# Altium schematic sheet EVK xA1.SchDoc
size A2
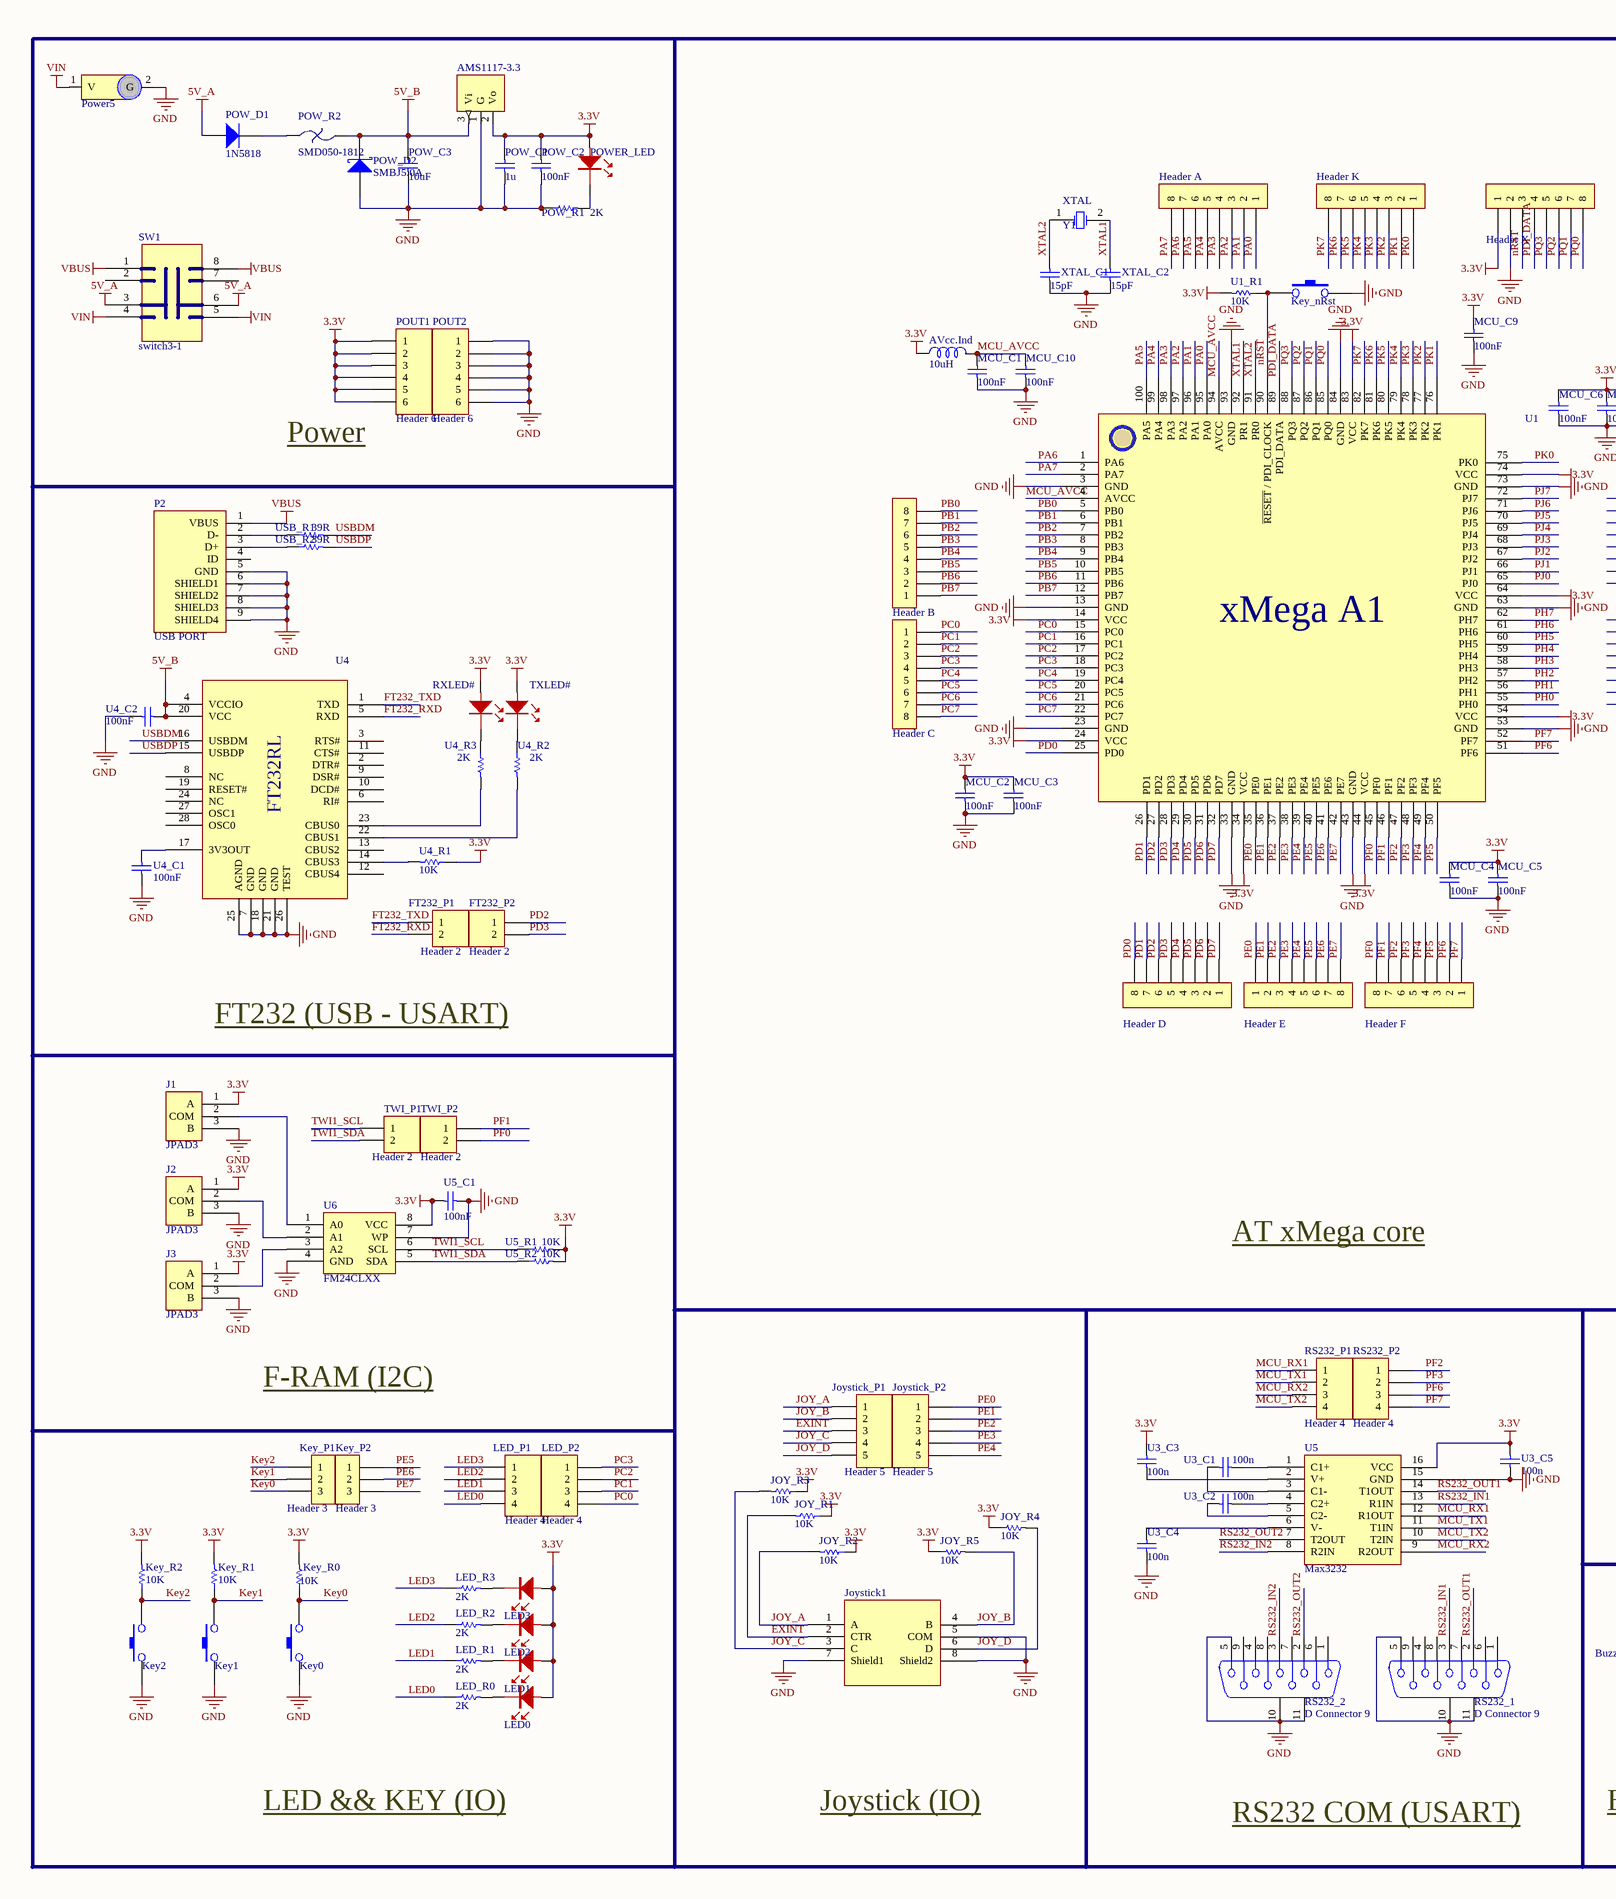
[diagram p0: EVK xA1.SchDoc, left]
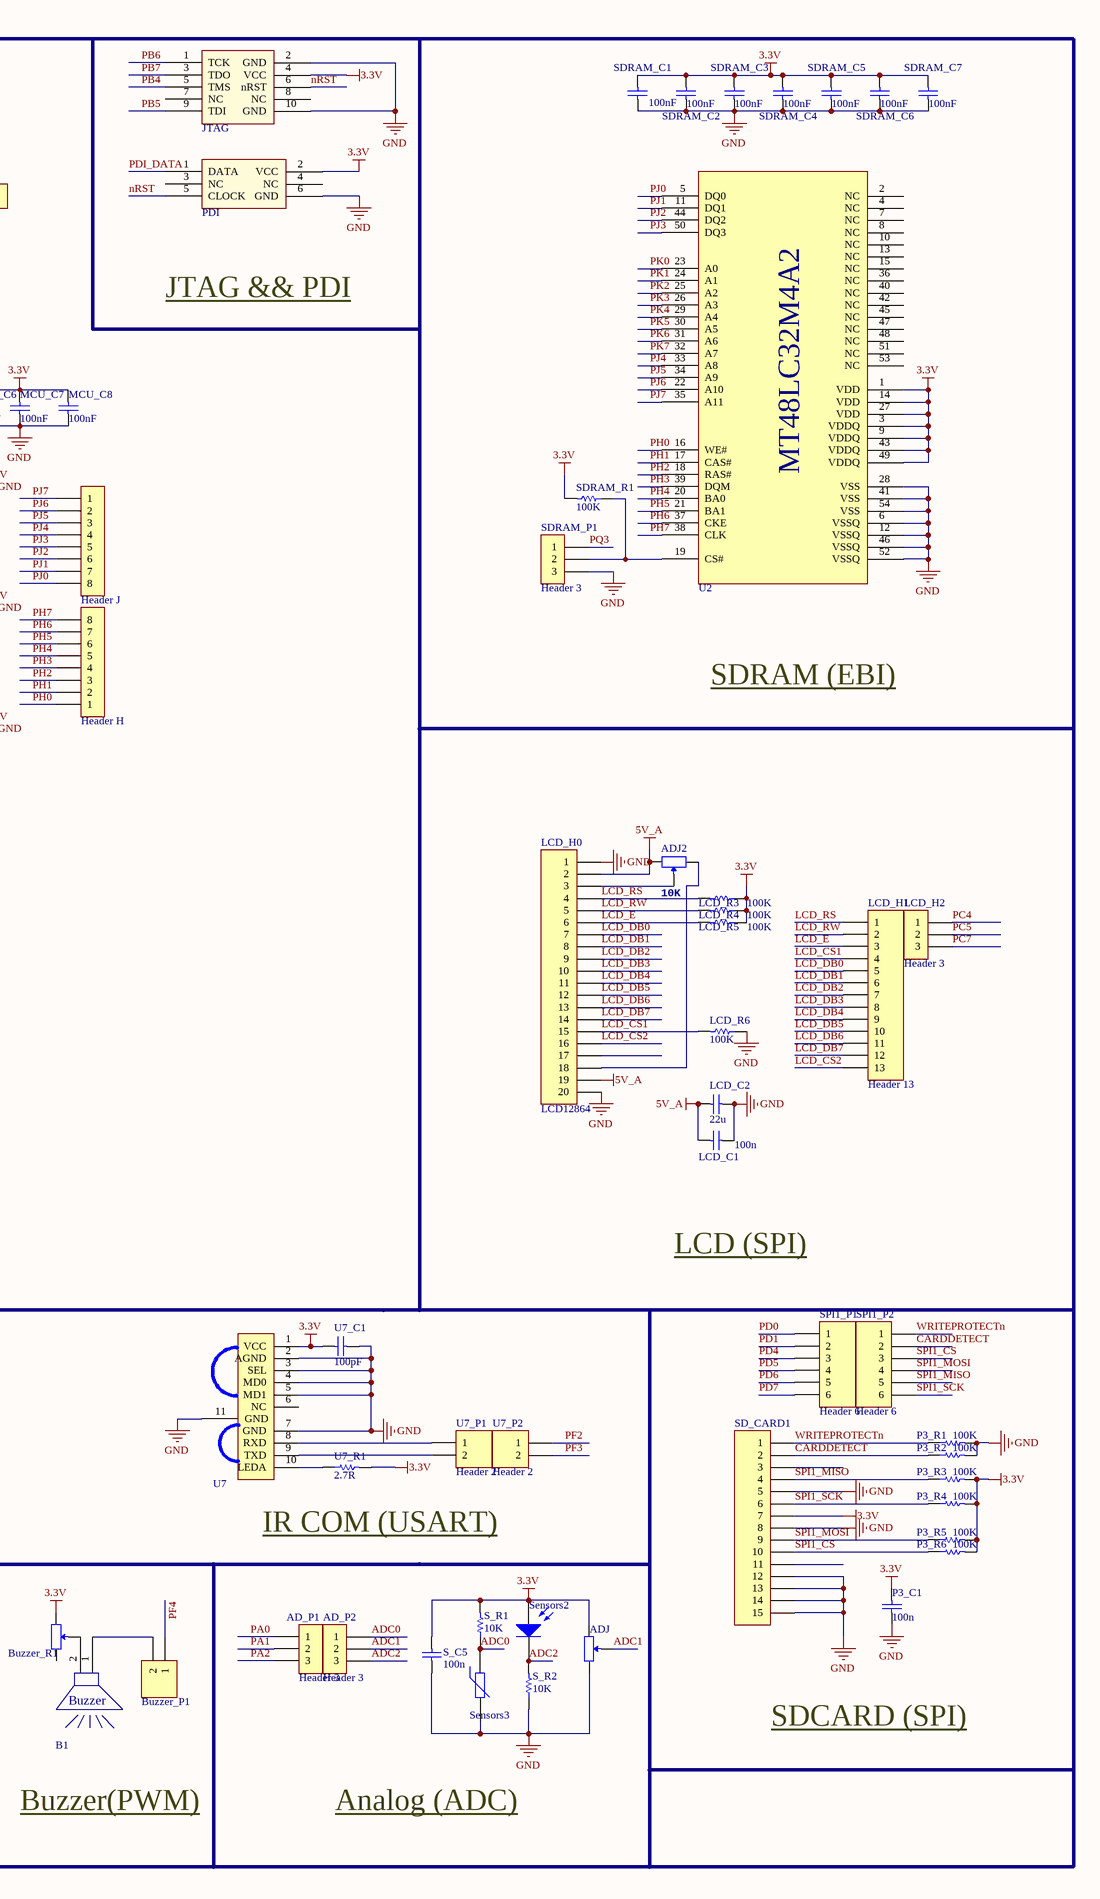
[diagram p1: EVK xA1.SchDoc, right]

## Parts
AD_P1  Header 3  [SIP3]
AD_P2  Header 3  [SIP3]
ADJ  RES_ADJ  [RESADJ]  (value not drawn)
ADJ2  10K  [RESADJ]
AMS1117-3.3  LD1117  [LD1117-3.3]  (value not drawn)
AVcc.Ind  10uH  [RES]
B1  Buzzer  [buzzer]  (value not drawn)
Buzzer_P1  Header 2  [SIP2]  (value not drawn)
Buzzer_R1  RES_ADJ  [RESADJ2]  (value not drawn)
FT232_P1  Header 2  [SIP2]
FT232_P2  Header 2  [SIP2]
Header_A  Header 8  [SIP8]  (value not drawn)
Header_B  Header 8  [SIP8]  (value not drawn)
Header_C  Header 8  [SIP8]  (value not drawn)
Header_D  Header 8  [SIP8]  (value not drawn)
Header_E  Header 8  [SIP8]  (value not drawn)
Header_F  Header 8  [SIP8]  (value not drawn)
Header_H  Header 8  [SIP8]  (value not drawn)
Header_J  Header 8  [SIP8]  (value not drawn)
Header_K  Header 8  [SIP8]  (value not drawn)
Header_X  Header 8  [SIP8]  (value not drawn)
J1  JPAD3  [JPAD3]
J2  JPAD3  [JPAD3]
J3  JPAD3  [JPAD3]
JOY_R1  value 10K  [0805]  (hidden comment: R_0805)
JOY_R2  value 10K  [0805]  (hidden comment: R_0805)
JOY_R3  value 10K  [0805]  (hidden comment: R_0805)
JOY_R4  value 10K  [0805]  (hidden comment: R_0805)
JOY_R5  value 10K  [0805]  (hidden comment: R_0805)
Joystick1  Joystick  [Joystick]  (value not drawn)
Joystick_P1  Header 5  [SIP5]
Joystick_P2  Header 5  [SIP5]
JTAG  JTAG  [ISP_10]  (value not drawn)
Key0  PB2  [KEY]  (value not drawn)
Key1  PB2  [KEY]  (value not drawn)
Key2  PB2  [KEY]  (value not drawn)
Key_nRst  PB2  [KEY]  (value not drawn)
Key_P1  Header 3  [SIP3]
Key_P2  Header 3  [SIP3]
Key_R0  value 10K  [0805]  (hidden comment: R_0805)
Key_R1  value 10K  [0805]  (hidden comment: R_0805)
Key_R2  value 10K  [0805]  (hidden comment: R_0805)
LCD_C1  value 100n  [0805]  (hidden comment: C_0805)
LCD_C2  value 22u  [0805]  (hidden comment: C_0805)
LCD_H0  LCD12864  [SIP20]
LCD_H1  Header 13  [SIP13]
LCD_H2  Header 3  [SIP3]
LCD_R3  value 100K  [0805]  (hidden comment: R_0805)
LCD_R4  value 100K  [0805]  (hidden comment: R_0805)
LCD_R5  value 100K  [0805]  (hidden comment: R_0805)
LCD_R6  value 100K  [0805]  (hidden comment: R_0805)
LED0  LED_0805  [0805_LED]  (value not drawn)
LED1  LED_0805  [0805_LED]  (value not drawn)
LED2  LED_0805  [0805_LED]  (value not drawn)
LED3  LED_0805  [0805_LED]  (value not drawn)
LED_P1  Header 4  [SIP4]
LED_P2  Header 4  [SIP4]
LED_R0  value 2K  [0805]  (hidden comment: R_0805)
LED_R1  value 2K  [0805]  (hidden comment: R_0805)
LED_R2  value 2K  [0805]  (hidden comment: R_0805)
LED_R3  value 2K  [0805]  (hidden comment: R_0805)
MCU_C1  value 100nF  [0805]  (hidden comment: C_0805)
MCU_C2  value 100nF  [0805]  (hidden comment: C_0805)
MCU_C3  value 100nF  [0805]  (hidden comment: C_0805)
MCU_C4  value 100nF  [0805]  (hidden comment: C_0805)
MCU_C5  value 100nF  [0805]  (hidden comment: C_0805)
MCU_C6  value 100nF  [0805]  (hidden comment: C_0805)
MCU_C7  value 100nF  [0805]  (hidden comment: C_0805)
MCU_C8  value 100nF  [0805]  (hidden comment: C_0805)
MCU_C9  value 100nF  [0805]  (hidden comment: C_0805)
MCU_C10  value 100nF  [0805]  (hidden comment: C_0805)
P2  USB PORT  [USB2]
P3_C1  value 100n  [0805]  (hidden comment: C_0805)
P3_R1  value 100K  [0805]  (hidden comment: R_0805)
P3_R2  value 100K  [0805]  (hidden comment: R_0805)
P3_R3  value 100K  [0805]  (hidden comment: R_0805)
P3_R4  value 100K  [0805]  (hidden comment: R_0805)
P3_R5  value 100K  [0805]  (hidden comment: R_0805)
P3_R6  value 100K  [0805]  (hidden comment: R_0805)
PDI  PDI  [ISP_6]  (value not drawn)
POUT1  Header 6  [SIP6]
POUT2  Header 6  [SIP6]
POW_C1  value 1u  [0805]  (hidden comment: C_0805)
POW_C2  value 100nF  [0805]  (hidden comment: C_0805)
POW_C3  value 10uF  [0805]  (hidden comment: C_0805)
POW_D1  1N5818  [diode]
POW_D2  SMBJ5.0A  [SMBJ]
POW_R1  value 2K  [0805]  (hidden comment: R_0805)
POW_R2  SMD050-1812  [SMD-1812]
Power5  5V  [PWR_5V]  (value not drawn)
POWER_LED  LED_0805  [0805_LED]  (value not drawn)
RS232_1  D Connector 9  [DB9_2]
RS232_2  D Connector 9  [DB9_2]
RS232_P1  Header 4  [SIP4]
RS232_P2  Header 4  [SIP4]
RXLED#  LED_0805  [0805_LED]  (value not drawn)
S_C5  value 100n  [0805]  (hidden comment: C_0805)
S_R1  value 10K  [0805]  (hidden comment: R_0805)
S_R2  value 10K  [0805]  (hidden comment: R_0805)
SD_CARD1  SDCARD  [SDK]  (value not drawn)
SDRAM_C1  value 100nF  [0805]  (hidden comment: C_0805)
SDRAM_C2  value 100nF  [0805]  (hidden comment: C_0805)
SDRAM_C3  value 100nF  [0805]  (hidden comment: C_0805)
SDRAM_C4  value 100nF  [0805]  (hidden comment: C_0805)
SDRAM_C5  value 100nF  [0805]  (hidden comment: C_0805)
SDRAM_C6  value 100nF  [0805]  (hidden comment: C_0805)
SDRAM_C7  value 100nF  [0805]  (hidden comment: C_0805)
SDRAM_P1  Header 3  [SIP3]
SDRAM_R1  value 100K  [0805]  (hidden comment: R_0603)
Sensors2  Photo Sen  [LED]  (value not drawn)
Sensors3  Res Varistor  [diode]  (value not drawn)
SPI1_P1  Header 6  [SIP6]
SPI1_P2  Header 6  [SIP6]
SW1  switch3-1  [Switch3-1]
TWI_P1  Header 2  [SIP2]
TWI_P2  Header 2  [SIP2]
TXLED#  LED_0805  [0805_LED]  (value not drawn)
U1  xMega A1  [TQFP100 CORE]  (value not drawn)
U1_R1  value 10K  [0805]  (hidden comment: R_0805)
U2  MT48LC32M4A2  [TSOP54]  (value not drawn)
U3_C1  value 100n  [0805]  (hidden comment: C_0805)
U3_C2  value 100n  [0805]  (hidden comment: C_0805)
U3_C3  value 100n  [0805]  (hidden comment: C_0805)
U3_C4  value 100n  [0805]  (hidden comment: C_0805)
U3_C5  value 100n  [0805]  (hidden comment: C_0805)
U4  FT232RL  [SSOP28]  (value not drawn)
U4_C1  value 100nF  [0805]  (hidden comment: C_0805)
U4_C2  value 100nF  [0805]  (hidden comment: C_0805)
U4_R1  value 10K  [0805]  (hidden comment: R_0805)
U4_R2  value 2K  [0805]  (hidden comment: R_0805)
U4_R3  value 2K  [0805]  (hidden comment: R_0805)
U5  Max3232  [SOP16]
U5_C1  value 100nF  [0805]  (hidden comment: C_0805)
U5_R1  value 10K  [0805]  (hidden comment: R_0805)
U5_R2  value 10K  [0805]  (hidden comment: R_0805)
U6  FM24CLXX  [AT24C]
U7  HSDL-3602-007  [HSDL-3602-007]  (value not drawn)
U7_C1  value 100pF  [0805]  (hidden comment: C_0805)
U7_P1  Header 2  [SIP2]
U7_P2  Header 2  [SIP2]
U7_R1  value 2.7R  [0805]  (hidden comment: R_0805)
USB_R1  value 39R  [0805]  (hidden comment: R_0805)
USB_R2  value 39R  [0805]  (hidden comment: R_0805)
XTAL_C1  value 15pF  [0805]  (hidden comment: Cap)
XTAL_C2  value 15pF  [0805]  (hidden comment: Cap)
Y1  XTAL  [CRYSTAL]

## Nets
3.3V: ADJ.1(A) AMS1117-3.3.2(Vo) AVcc.Ind.1 Buzzer_R1.1(A) Header_X.1 J1.1(A) J2.1(A) J3.1(A) JOY_R1.1 JOY_R2.1 JOY_R3.1 JOY_R4.1 JOY_R5.1 JTAG.4(VCC) Key_R0.2 Key_R1.2 Key_R2.2 LCD_R3.1 LCD_R4.1 LCD_R5.1 LED0.1 LED1.1 LED2.1 LED3.1 MCU_C2.2 MCU_C3.2 MCU_C4.2 MCU_C5.2 MCU_C6.2 MCU_C7.2 MCU_C8.2 MCU_C9.2 P3_C1.2 P3_R3.2 P3_R4.2 P3_R5.2 P3_R6.2 PDI.2(VCC) POUT1.1 POUT1.2 POUT1.3 POUT1.4 POUT1.5 POUT1.6 POW_C1.2 POW_C2.2 POWER_LED.1 RXLED#.1 S_C5.2 S_R1.2 SD_CARD1.7 SDRAM_C1.1 SDRAM_C2.1 SDRAM_C3.1 SDRAM_C4.1 SDRAM_C5.1 SDRAM_C6.1 SDRAM_C7.1 SDRAM_R1.2 Sensors2.1(A) TXLED#.1 U1.14(VCC) U1.24(VCC) U1.34(VCC) U1.44(VCC) U1.54(VCC) U1.64(VCC) U1.74(VCC) U1.83(VCC) U1_R1.2 U2.1(VDD) U2.3(VDDQ) U2.9(VDDQ) U2.14(VDD) U2.27(VDD) U2.43(VDDQ) U2.49(VDDQ) U3_C3.2 U3_C5.1 U4_R1.1 U5.16(VCC) U5_C1.2 U5_R1.2 U5_R2.2 U6.8(VCC) U7.1(VCC) U7_C1.2 U7_R1.2
5V_A: ADJ2.3(B) LCD_C1.2 LCD_C2.2 LCD_H0.2 LCD_H0.19 POW_D1.1(A) SW1.3 SW1.6
5V_B: AMS1117-3.3.3(Vi) POW_C3.2 POW_D2.2(K) POW_R2.2 U4.4(VCCIO) U4.20(VCC) U4_C2.1
GND: ADJ.3(B) AMS1117-3.3.1(G) Header_X.2 J1.3(B) J2.3(B) J3.3(B) Joystick1.5(COM) Joystick1.7(Shield1) Joystick1.8(Shield2) JTAG.2(GND) JTAG.10(GND) Key0.1 Key1.1 Key2.1 Key_nRst.2 LCD_C1.1 LCD_C2.1 LCD_H0.1 LCD_H0.20 LCD_R6.1 MCU_C1.1 MCU_C2.1 MCU_C3.1 MCU_C4.1 MCU_C5.1 MCU_C6.1 MCU_C7.1 MCU_C8.1 MCU_C9.1 MCU_C10.1 P2.5(GND) P2.6(SHIELD1) P2.7(SHIELD2) P2.8(SHIELD3) P2.9(SHIELD4) P3_C1.1 P3_R1.2 P3_R2.2 PDI.6(GND) POUT2.1 POUT2.2 POUT2.3 POUT2.4 POUT2.5 POUT2.6 POW_C1.1 POW_C2.1 POW_C3.1 POW_D2.1(A) POW_R1.1 Power5.2(G) RS232_1.5 RS232_1.10(MH1) RS232_1.11(MH2) RS232_2.5 RS232_2.10(MH1) RS232_2.11(MH2) S_C5.1 S_R2.1 SD_CARD1.5 SD_CARD1.8 SD_CARD1.12 SD_CARD1.13 SD_CARD1.14 SD_CARD1.15 SDRAM_C1.2 SDRAM_C2.2 SDRAM_C3.2 SDRAM_C4.2 SDRAM_C5.2 SDRAM_C6.2 SDRAM_C7.2 SDRAM_P1.3 Sensors3.2 U1.3(GND) U1.13(GND) U1.23(GND) U1.33(GND) U1.43(GND) U1.53(GND) U1.63(GND) U1.73(GND) U1.84(GND) U1.93(GND) U2.6(VSSQ) U2.12(VSSQ) U2.28(VSS) U2.41(VSS) U2.46(VSSQ) U2.52(VSSQ) U2.54(VSS) U3_C4.1 U3_C5.2 U4.7(GND) U4.18(GND) U4.21(GND) U4.25(AGND) U4.26(TEST) U4_C1.1 U4_C2.2 U5.15(GND) U5_C1.1 U6.4(GND) U6.7(WP) U7.2(AGND) U7.3(SEL) U7.4(MD0) U7.5(MD1) U7.7(GND) U7.11(GND) U7_C1.1 XTAL_C1.1 XTAL_C2.1
VBUS: P2.1(VBUS) SW1.1 SW1.8
VIN: Power5.1(V) SW1.4 SW1.5
ADC0: AD_P2.1 S_R1.1 Sensors3.1
ADC1: AD_P2.2 ADJ.2(TAP)
ADC2: AD_P2.3 S_R2.2 Sensors2.2(K)
CARDDETECT: P3_R2.1 SD_CARD1.2 SPI1_P2.2
EXINT: JOY_R1.2 Joystick1.2(CTR) Joystick_P1.3
FT232_RXD: FT232_P1.2 U4.5(RXD)
FT232_TXD: FT232_P1.1 U4.1(TXD)
JOY_A: JOY_R2.2 Joystick1.1(A) Joystick_P1.1
JOY_B: JOY_R5.2 Joystick1.4(B) Joystick_P1.2
JOY_C: JOY_R3.2 Joystick1.3(C) Joystick_P1.4
JOY_D: JOY_R4.2 Joystick1.6(D) Joystick_P1.5
Key0: Key0.2 Key_P1.3 Key_R0.1
Key1: Key1.2 Key_P1.2 Key_R1.1
Key2: Key2.2 Key_P1.1 Key_R2.1
LCD_CS1: LCD_H0.15 LCD_H1.4 LCD_R6.2
LCD_CS2: LCD_H0.16 LCD_H1.13
LCD_DB0: LCD_H0.7 LCD_H1.5
LCD_DB1: LCD_H0.8 LCD_H1.6
LCD_DB2: LCD_H0.9 LCD_H1.7
LCD_DB3: LCD_H0.10 LCD_H1.8
LCD_DB4: LCD_H0.11 LCD_H1.9
LCD_DB5: LCD_H0.12 LCD_H1.10
LCD_DB6: LCD_H0.13 LCD_H1.11
LCD_DB7: LCD_H0.14 LCD_H1.12
LCD_E: LCD_H0.6 LCD_H1.3 LCD_R5.2
LCD_RS: LCD_H0.4 LCD_H1.1 LCD_R3.2
LCD_RW: LCD_H0.5 LCD_H1.2 LCD_R4.2
LED0: LED_P1.4 LED_R0.1
LED1: LED_P1.3 LED_R1.1
LED2: LED_P1.2 LED_R2.1
LED3: LED_P1.1 LED_R3.1
MCU_AVCC: AVcc.Ind.2 MCU_C1.2 MCU_C10.2 U1.4(AVCC) U1.94(AVCC)
MCU_RX1: RS232_P1.1 U5.12(R1OUT)
MCU_RX2: RS232_P1.3 U5.9(R2OUT)
MCU_TX1: RS232_P1.2 U5.11(T1IN)
MCU_TX2: RS232_P1.4 U5.10(T2IN)
nRST: Header_X.3 JTAG.6(nRST) Key_nRst.1 PDI.5(CLOCK) U1.90(~{RESET}_/_PDI_CLOCK) U1_R1.1
PA0: AD_P1.1 Header_A.1 U1.95(PA0)
PA1: AD_P1.2 Header_A.2 U1.96(PA1)
PA2: AD_P1.3 Header_A.3 U1.97(PA2)
PA3: Header_A.4 U1.98(PA3)
PA4: Header_A.5 U1.99(PA4)
PA5: Header_A.6 U1.100(PA5)
PA6: Header_A.7 U1.1(PA6)
PA7: Header_A.8 U1.2(PA7)
PB0: Header_B.8 U1.5(PB0)
PB1: Header_B.7 U1.6(PB1)
PB2: Header_B.6 U1.7(PB2)
PB3: Header_B.5 U1.8(PB3)
PB4: Header_B.4 JTAG.5(TMS) U1.9(PB4)
PB5: Header_B.3 JTAG.9(TDI) U1.10(PB5)
PB6: Header_B.2 JTAG.1(TCK) U1.11(PB6)
PB7: Header_B.1 JTAG.3(TDO) U1.12(PB7)
PC0: Header_C.1 LED_P2.4 U1.15(PC0)
PC1: Header_C.2 LED_P2.3 U1.16(PC1)
PC2: Header_C.3 LED_P2.2 U1.17(PC2)
PC3: Header_C.4 LED_P2.1 U1.18(PC3)
PC4: Header_C.5 LCD_H2.1 U1.19(PC4)
PC5: Header_C.6 LCD_H2.2 U1.20(PC5)
PC6: Header_C.7 U1.21(PC6)
PC7: Header_C.8 LCD_H2.3 U1.22(PC7)
PD0: Header_D.8 SPI1_P1.1 U1.25(PD0)
PD1: Header_D.7 SPI1_P1.2 U1.26(PD1)
PD2: FT232_P2.1 Header_D.6 U1.27(PD2)
PD3: FT232_P2.2 Header_D.5 U1.28(PD3)
PD4: Header_D.4 SPI1_P1.3 U1.29(PD4)
PD5: Header_D.3 SPI1_P1.4 U1.30(PD5)
PD6: Header_D.2 SPI1_P1.5 U1.31(PD6)
PD7: Header_D.1 SPI1_P1.6 U1.32(PD7)
PDI_DATA: Header_X.4 PDI.1(DATA) U1.89(PDI_DATA)
PE0: Header_E.1 Joystick_P2.1 U1.35(PE0)
PE1: Header_E.2 Joystick_P2.2 U1.36(PE1)
PE2: Header_E.3 Joystick_P2.3 U1.37(PE2)
PE3: Header_E.4 Joystick_P2.4 U1.38(PE3)
PE4: Header_E.5 Joystick_P2.5 U1.39(PE4)
PE5: Header_E.6 Key_P2.1 U1.40(PE5)
PE6: Header_E.7 Key_P2.2 U1.41(PE6)
PE7: Header_E.8 Key_P2.3 U1.42(PE7)
PF0: Header_F.8 TWI_P2.2 U1.45(PF0)
PF1: Header_F.7 TWI_P2.1 U1.46(PF1)
PF2: Header_F.6 RS232_P2.1 U1.47(PF2) U7_P2.1
PF3: Header_F.5 RS232_P2.2 U1.48(PF3) U7_P2.2
PF4: Buzzer_P1.1 Header_F.4 U1.49(PF4)
PF5: Header_F.3 U1.50(PF5)
PF6: Header_F.2 RS232_P2.3 U1.51(PF6)
PF7: Header_F.1 RS232_P2.4 U1.52(PF7)
PH0: Header_H.1 U1.55(PH0) U2.16(WE#)
PH1: Header_H.2 U1.56(PH1) U2.17(CAS#)
PH2: Header_H.3 U1.57(PH2) U2.18(RAS#)
PH3: Header_H.4 U1.58(PH3) U2.39(DQM)
PH4: Header_H.5 U1.59(PH4) U2.20(BA0)
PH5: Header_H.6 U1.60(PH5) U2.21(BA1)
PH6: Header_H.7 U1.61(PH6) U2.37(CKE)
PH7: Header_H.8 U1.62(PH7) U2.38(CLK)
PJ0: Header_J.8 U1.65(PJ0) U2.5(DQ0)
PJ1: Header_J.7 U1.66(PJ1) U2.11(DQ1)
PJ2: Header_J.6 U1.67(PJ2) U2.44(DQ2)
PJ3: Header_J.5 U1.68(PJ3) U2.50(DQ3)
PJ4: Header_J.4 U1.69(PJ4) U2.33(A8)
PJ5: Header_J.3 U1.70(PJ5) U2.34(A9)
PJ6: Header_J.2 U1.71(PJ6) U2.22(A10)
PJ7: Header_J.1 U1.72(PJ7) U2.35(A11)
PK0: Header_K.1 U1.75(PK0) U2.23(A0)
PK1: Header_K.2 U1.76(PK1) U2.24(A1)
PK2: Header_K.3 U1.77(PK2) U2.25(A2)
PK3: Header_K.4 U1.78(PK3) U2.26(A3)
PK4: Header_K.5 U1.79(PK4) U2.29(A4)
PK5: Header_K.6 U1.80(PK5) U2.30(A5)
PK6: Header_K.7 U1.81(PK6) U2.31(A6)
PK7: Header_K.8 U1.82(PK7) U2.32(A7)
PQ0: Header_X.8 U1.85(PQ0)
PQ1: Header_X.7 U1.86(PQ1)
PQ2: Header_X.6 U1.87(PQ2)
PQ3: Header_X.5 SDRAM_P1.1 U1.88(PQ3)
RS232_IN1: RS232_1.3 U5.13(R1IN)
RS232_IN2: RS232_2.3 U5.8(R2IN)
RS232_OUT1: RS232_1.2 U5.14(T1OUT)
RS232_OUT2: RS232_2.2 U5.7(T2OUT)
SPI1_CS: P3_R6.1 SD_CARD1.10 SPI1_P2.3
SPI1_MISO: P3_R3.1 SD_CARD1.4 SPI1_P2.5
SPI1_MOSI: P3_R5.1 SD_CARD1.9 SPI1_P2.4
SPI1_SCK: P3_R4.1 SD_CARD1.6 SPI1_P2.6
TWI1_SCL: TWI_P1.1 U5_R1.1 U6.6(SCL)
TWI1_SDA: TWI_P1.2 U5_R2.1 U6.5(SDA)
USBDM: U4.16(USBDM) USB_R1.2
USBDP: U4.15(USBDP) USB_R2.2
WRITEPROTECTn: P3_R1.1 SD_CARD1.1 SPI1_P2.1
XTAL1: U1.92(PR1) XTAL_C2.2 Y1.2(OSC2)
XTAL2: U1.91(PR0) XTAL_C1.2 Y1.1(OSC1)
NetADJ2_1: ADJ2.1(A) LCD_H0.18
NetADJ2_2: ADJ2.2(TAP) LCD_H0.3
NetB1_1: B1.1 Buzzer_P1.2
NetB1_2: B1.2 Buzzer_R1.2(TAP)
NetJ1_2: J1.2(COM) U6.1(A0)
NetJ2_2: J2.2(COM) U6.2(A1)
NetJ3_2: J3.2(COM) U6.3(A2)
NetLED0_2: LED0.2 LED_R0.2
NetLED1_2: LED1.2 LED_R1.2
NetLED2_2: LED2.2 LED_R2.2
NetLED3_2: LED3.2 LED_R3.2
NetP2_2: P2.2(D-) USB_R1.1
NetP2_3: P2.3(D+) USB_R2.1
NetPOW_D1_2: POW_D1.2(K) POW_R2.1
NetPOW_R1_2: POW_R1.2 POWER_LED.2
NetRXLED#_2: RXLED#.2 U4_R3.1
NetSDRAM_P1_2: SDRAM_P1.2 SDRAM_R1.1 U2.19(CS#)
NetTXLED#_2: TXLED#.2 U4_R2.1
NetU3_C1_1: U3_C1.1 U5.1(C1+)
NetU3_C1_2: U3_C1.2 U5.3(C1-)
NetU3_C2_1: U3_C2.1 U5.4(C2+)
NetU3_C2_2: U3_C2.2 U5.5(C2-)
NetU3_C3_1: U3_C3.1 U5.2(V+)
NetU3_C4_2: U3_C4.2 U5.6(V-)
NetU4_14: U4.14(CBUS3) U4_R1.2
NetU4_17: U4.17(3V3OUT) U4_C1.2
NetU4_22: U4.22(CBUS1) U4_R2.2
NetU4_23: U4.23(CBUS0) U4_R3.2
NetU7_8: U7.8(RXD) U7_P1.1
NetU7_9: U7.9(TXD) U7_P1.2
NetU7_10: U7.10(LEDA) U7_R1.1

Not connected (* = marked no-connect by the designer): Buzzer_R1 3(B); JTAG 7(NC) 8(NC); LCD_H0 17; P2 4(ID); PDI 3(NC) 4(NC); RS232_1 1 4 6 7 8 9; RS232_2 1 4 6 7 8 9; SD_CARD1 3 11; SW1 2 7; U2 2(NC) 4(NC) 7(NC) 8(NC) 10(NC) 13(NC) 15(NC) 36(NC) 40(NC) 42(NC) 45(NC) 47(NC) 48(NC) 51(NC) 53(NC); U4 2(DTR#) 3(RTS#) 6(RI#) 8(NC) 9(DSR#) 10(DCD#) 11(CTS#) 12(CBUS4) 13(CBUS2) 19(RESET#) 24(NC) 27(OSC1) 28(OSC0); U7 6(NC)

## Notes on the sheet
- JTAG && PDI
- (near POUT1) Power
- SDRAM (EBI)
- FT232 (USB - USART)
- AT xMega core
- LCD (SPI)
- F-RAM (I2C)
- IR COM (USART)
- SDCARD (SPI)
- LED && KEY (IO)
- Joystick (IO)
- RS232 COM (USART)
- Buzzer(PWM)
- Analog (ADC)

## Library data of the parts
AD_P1 AD_P2 Key_P1 Key_P2 LCD_H2 SDRAM_P1 = Header 3: Header, 3-Pin
ADJ2 = RES_ADJ
AVcc.Ind = IND
Buzzer_P1 FT232_P1 FT232_P2 TWI_P1 TWI_P2 U7_P1 U7_P2 = Header 2: Header, 2-Pin; LatestRevisionDate: 17-Jul-2002; LatestRevisionNote: Re-released for DXP Platform.; Publisher: Altium Limited
Header_A Header_B Header_C Header_D Header_E Header_F Header_H Header_J Header_K Header_X = Header 8: Header, 8-Pin
JOY_R1-JOY_R5 Key_R0-Key_R2 LCD_R3-LCD_R6 LED_R0-LED_R3 P3_R1-P3_R6 POW_R1 S_R1 S_R2 U1_R1 U4_R1-U4_R3 U5_R1 U5_R2 U7_R1 USB_R1 USB_R2 = R_0805: Resistor
Joystick_P1 Joystick_P2 = Header 5: Header, 5-Pin; LatestRevisionDate: 17-Jul-2002; LatestRevisionNote: Re-released for DXP Platform.; Publisher: Altium Limited
Key0-Key2 Key_nRst = KEY
LCD_C1 LCD_C2 MCU_C1-MCU_C10 P3_C1 POW_C1-POW_C3 S_C5 SDRAM_C1-SDRAM_C7 U3_C1-U3_C5 U4_C1 U4_C2 U5_C1 U7_C1 = C_0805: Capacitor
LCD_H0 = Header 20: Header, 20-Pin; LatestRevisionDate: 17-Jul-2002; LatestRevisionNote: Re-released for DXP Platform.; Publisher: Altium Limited
LCD_H1 = Header 13: Header, 13-Pin; LatestRevisionDate: 17-Jul-2002; LatestRevisionNote: Re-released for DXP Platform.; Publisher: Altium Limited
LED_P1 LED_P2 RS232_P1 RS232_P2 = Header 4: Header, 4-Pin; LatestRevisionDate: 17-Jul-2002; LatestRevisionNote: Re-released for DXP Platform.; Publisher: Altium Limited
P2 = USB
POUT1 POUT2 SPI1_P1 SPI1_P2 = Header 6: Header, 6-Pin; LatestRevisionDate: 17-Jul-2002; LatestRevisionNote: Re-released for DXP Platform.; Publisher: Altium Limited
POW_D1 = Diode 1N: 1 Amp General Purpose Rectifier
Power5 = Power5
RS232_1 RS232_2 = D Connector 9: Receptacle Assembly, 9 Position, Right Angle
SD_CARD1 = SDCARD: Header, 15-Pin
SDRAM_R1 = R_0603: Resistor
Sensors2 = Photo Sen: Photosensitive Diode
Sensors3 = Res Varistor: Varistor (Voltage-Sensitive Resistor)
U6 = AT24C
XTAL_C1 XTAL_C2 = Cap: Capacitor
Y1 = XTAL: Crystal Oscillator; Published: 8-Jun-2000; LatestRevisionDate: 17-Jul-2002; LatestRevisionNote: Re-released for DXP Platform.; PackageReference: R38; Publisher: Altium Limited